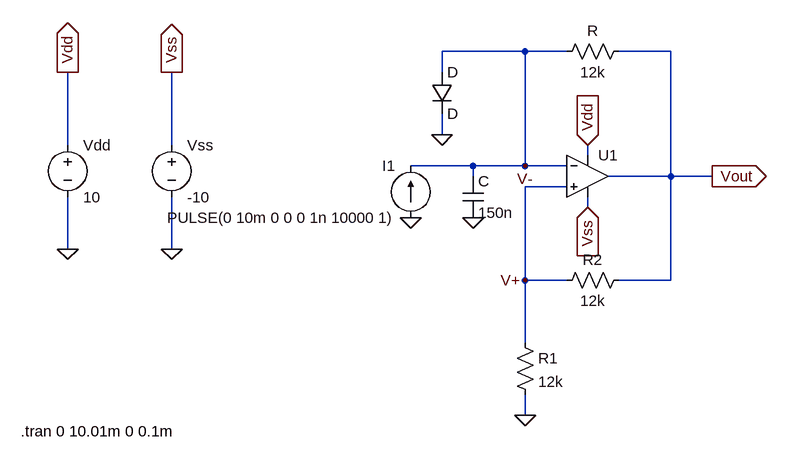
[diagram p0: schematic Draft1_stabile.asc]
Draft1_stabile.asc, the LTspice schematic file:
Version 4
SHEET 1 880 680
WIRE 144 -32 16 -32
WIRE 208 -32 144 -32
WIRE 368 -32 288 -32
WIRE 16 0 16 -32
WIRE 16 96 16 64
WIRE -560 112 -560 0
WIRE -400 112 -400 0
WIRE 240 128 240 112
WIRE 64 144 -32 144
WIRE 144 144 144 -32
WIRE 144 144 64 144
WIRE 208 144 144 144
WIRE 64 160 64 144
WIRE 368 160 368 -32
WIRE 368 160 272 160
WIRE 432 160 368 160
WIRE 208 176 144 176
WIRE 240 208 240 192
WIRE -560 272 -560 192
WIRE -400 272 -400 192
WIRE 144 320 144 176
WIRE 208 320 144 320
WIRE 368 320 368 160
WIRE 368 320 288 320
WIRE 144 416 144 320
WIRE 144 528 144 496
FLAG 64 224 0
FLAG 16 96 0
FLAG 144 528 0
FLAG 240 112 Vdd
IOPIN 240 112 In
FLAG 240 208 Vss
IOPIN 240 208 In
FLAG 432 160 Vout
IOPIN 432 160 Out
FLAG -560 272 0
FLAG -400 272 0
FLAG -560 0 Vdd
IOPIN -560 0 Out
FLAG -400 0 Vss
IOPIN -400 0 Out
FLAG -32 224 0
FLAG 144 144 V-
FLAG 144 320 V+
SYMBOL OpAmps\\UniversalOpAmp2 240 160 R0
SYMATTR InstName U1
SYMBOL res 304 304 R90
WINDOW 0 0 56 VBottom 2
WINDOW 3 32 56 VTop 2
SYMATTR InstName R2
SYMATTR Value 12k
SYMBOL res 304 -48 R90
WINDOW 0 0 56 VBottom 2
WINDOW 3 32 56 VTop 2
SYMATTR InstName R
SYMATTR Value 12k
SYMBOL cap 48 160 R0
SYMATTR InstName C
SYMATTR Value 150n
SYMBOL diode 0 0 R0
SYMATTR InstName D
SYMBOL res 128 400 R0
SYMATTR InstName R1
SYMATTR Value 12k
SYMBOL voltage -560 96 R0
WINDOW 123 0 0 Left 0
WINDOW 39 0 0 Left 0
SYMATTR InstName Vdd
SYMATTR Value 10
SYMBOL voltage -400 96 R0
WINDOW 123 0 0 Left 0
WINDOW 39 0 0 Left 0
SYMATTR InstName Vss
SYMATTR Value -10
SYMBOL current -32 224 R180
WINDOW 0 24 80 Left 2
WINDOW 3 24 0 Left 2
WINDOW 123 0 0 Left 0
WINDOW 39 0 0 Left 0
SYMATTR InstName I1
SYMATTR Value PULSE(0 10m 0 0 0 1n 10000 1)
TEXT -632 552 Left 2 !.tran 0 10.01m 0 0.1m

The netlist it stands for:
* Draft1_stabile.asc
XU1 V+ V- Vdd Vss Vout level2 Avol=1Meg GBW=10Meg Slew=10Meg Ilimit=25m Rail=0 Vos=0 En=0 Enk=0 In=0 Ink=0 Rin=500Meg  ; pins In+ In- V+ V- OUT
R2 Vout V+ 12k
R Vout V- 12k
C V- 0 150n
D V- 0 D
R1 V+ 0 12k
Vdd Vdd 0 10
Vss Vss 0 -10
I1 0 V- PULSE(0 10m 0 0 0 1n 10000 1)
.model D D
.lib standard.dio
.tran 0 10.01m 0 0.1m
.lib UniversalOpAmp2.lib
.backanno
.end

* Results of the author's LTspice run, read from the files saved beside the schematic
* Operating Point, zero values left out:
*   V(vdd) = 10 V
*   V(vss) = -10 V
*   I(Vss) = 999.5 µA
*   I(Vdd) = -999.5 µA
*   Ix(u1:3) = 999.5 µA
*   Ix(u1:4) = -999.5 µA
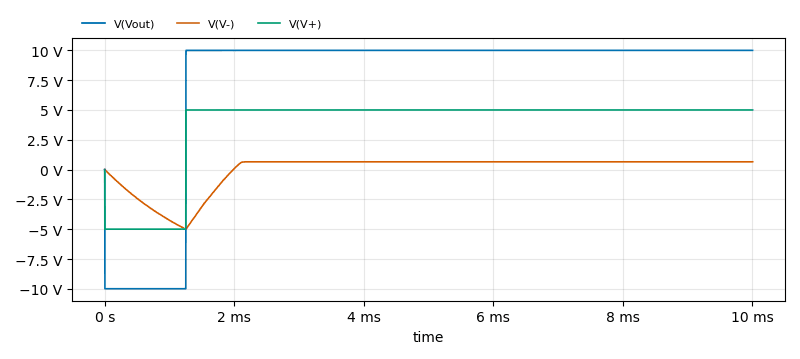
[diagram p1: Transient Analysis of Draft1_stabile.asc, plotted from the saved traces]
* Transient Analysis, 1 run:
*   V(Vout): min -9.991 V, max 9.988 V, average 7.487 V, rms 9.987 V, last 9.988 V
*   V(V-): min -5.007 V, max 648.8 mV, average -5.48 mV, rms 1.472 V, last 648.6 mV
*   V(V+): min -4.996 V, max 4.994 V, average 3.743 V, rms 4.993 V, last 4.994 V